# Altium schematic sheet PowerManager.SchDoc
size A4
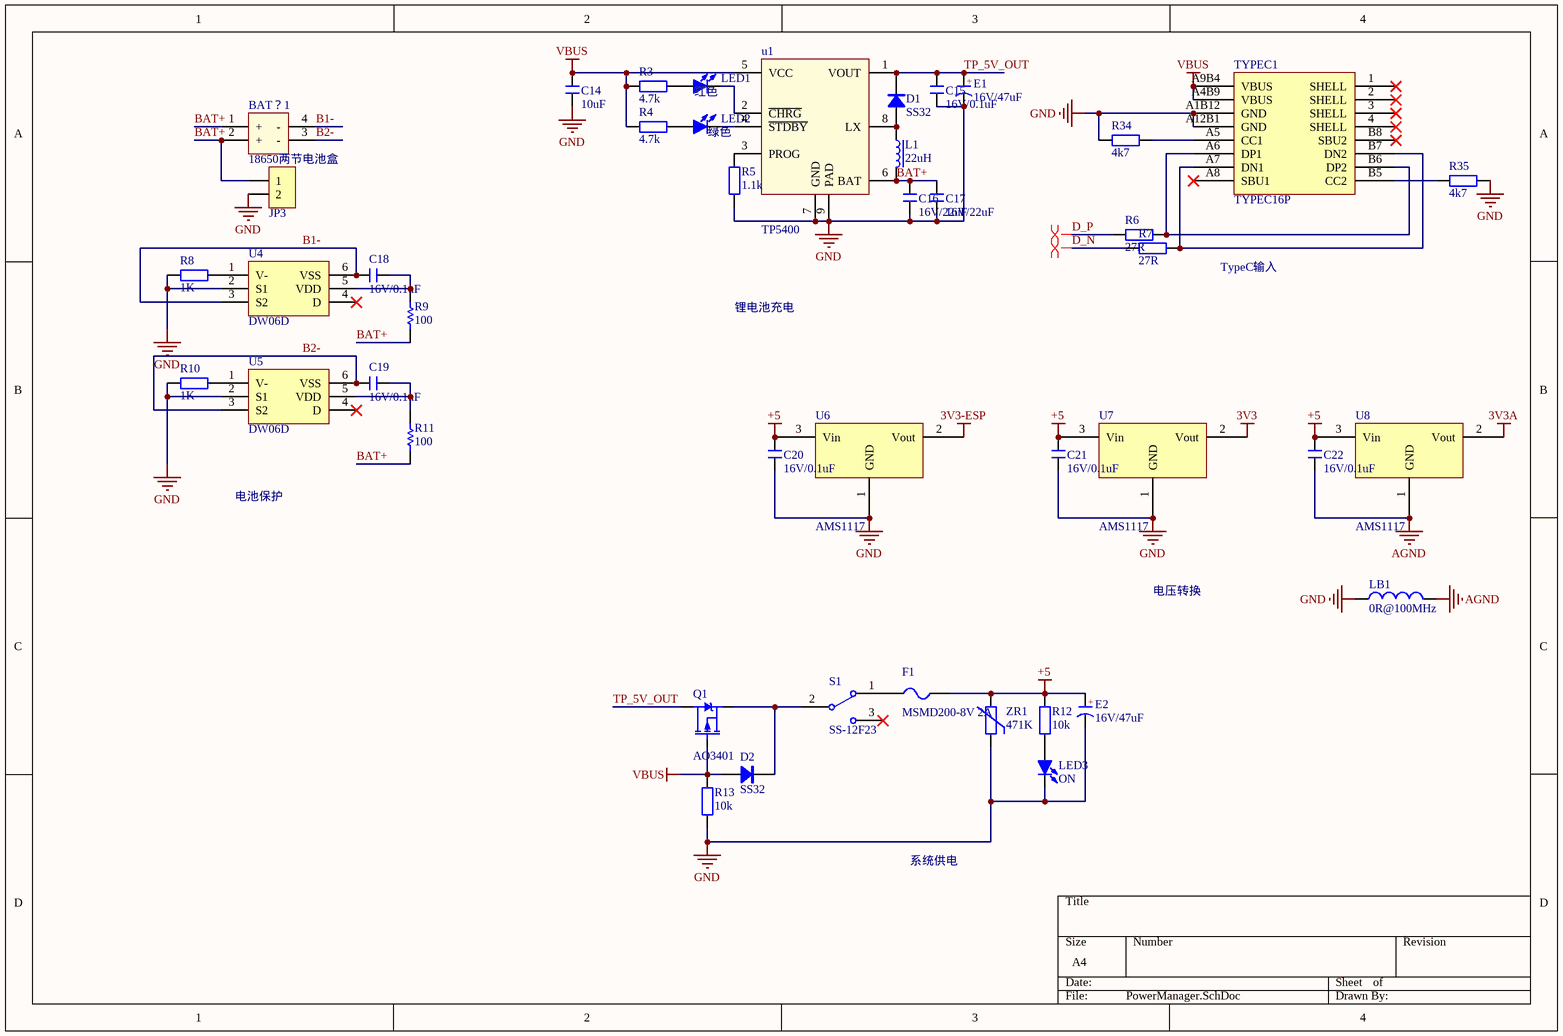
[diagram p0: PowerManager.SchDoc]

## Parts
BAT？1  18650两节电池盒  [18650两节电池盒]
C14  10uF  [C 0603_L]
C15  16V/0.1uF  [C 1206_L]
C16  16V/22uF  [C 1206_L]
C17  16V/22uF  [C 1206_L]
C18  16V/0.1uF  [C 1206_L]
C19  16V/0.1uF  [C 1206_L]
C20  16V/0.1uF  [C 1206_L]
C21  16V/0.1uF  [C 1206_L]
C22  16V/0.1uF  [C 1206_L]
D1  SS32  [SMA]
D2  SS32  [SMA]
E1  16V/47uF  [CM C(5*5.4)]
E2  16V/47uF  [CM C(5*5.4)]
F1  MSMD200-8V 2A  [FU 1206]
JP3  HDR-1X2  [XH2.54-WS-2P]  (value not drawn)
L1  22uH  [NR4020]
LB1  0R@100MHz  [FB 1206_L]
LED1  红色  [LED 0603R]
LED2  绿色  [LED 0603G]
LED3  ON  [LED 0603R]
Q1  AO3401  [SOT23]
R3  4.7k  [R 0603_L]
R4  4.7k  [R 0603_L]
R5  1.1k  [R 0603_L]
R6  27R  [R 0603_L]
R7  27R  [R 0603_L]
R8  1K  [R 0603_L]
R9  100  [0603R]
R10  1K  [R 0603_L]
R11  100  [0603R]
R12  10k  [R 0603_L]
R13  10k  [R 0603_L]
R34  4k7  [R 0603_L]
R35  4k7  [R 0603_L]
S1  SS-12F23  [SK-12D07VG3]
TYPEC1  TYPEC16P  [TYPEC-16P]
u1  TP5400  [ESOP8]
U4  DW06D  [SOT23-6]
U5  DW06D  [SOT23-6]
U6  AMS1117  [SOT89]
U7  AMS1117  [SOT89]
U8  AMS1117  [SOT89]
ZR1  471K  [R 0603_L]

## Nets
3V3: U7.2(Vout)
3V3-ESP: U6.2(Vout)
3V3A: U8.2(Vout)
+5: C20.2 C21.2 C22.2 E2.1(A) F1.2 R12.2 U6.3(Vin) U7.3(Vin) U8.3(Vin) ZR1.2
AGND: C22.1 LB1.2 U8.1(GND)
GND: C14.1 C15.1 C16.1 C17.1 C20.1 C21.1 E1.2(K) E2.2(K) JP3.2 LB1.1 LED3.2(K) R5.1 R8.1 R10.1 R13.1 R34.1 R35.1 TYPEC1.A1B12(GND) TYPEC1.A12B1(GND) u1.7(GND) u1.9(PAD) U4.2(S1) U5.2(S1) U6.1(GND) U7.1(GND) ZR1.1
VBUS: C14.2 D2.1(A) Q1.G R3.2 R4.2 R13.2 TYPEC1.A4B9(VBUS) TYPEC1.A9B4(VBUS) u1.5(VCC)
B1-: BAT？1.4(-) C18.2 U4.3(S2) U4.6(VSS)
B2-: BAT？1.3(-) C19.2 U5.3(S2) U5.6(VSS)
BAT+: BAT？1.1(+) BAT？1.2(+) C16.2 C17.2 JP3.1 L1.2 R9.2 R11.2 u1.6(BAT)
D_N: R7.1
D_P: R6.1
TP_5V_OUT: C15.2 D1.2(K) E1.1(A) Q1.D u1.1(VOUT)
NetC18_1: C18.1 R9.1 U4.5(VDD)
NetC19_1: C19.1 R11.1 U5.5(VDD)
NetD1_1: D1.1(A) L1.1 u1.8(LX)
NetD2_2: D2.2(K) Q1.S S1.2
NetF1_1: F1.1 S1.1
NetLED1_1: LED1.1(A) R3.1
NetLED1_2: LED1.2(K) u1.2(~{CHRG})
NetLED2_1: LED2.1(A) R4.1
NetLED2_2: LED2.2(K) u1.4(~{STDBY})
NetLED3_1: LED3.1(A) R12.1
NetR5_2: R5.2 u1.3(PROG)
NetR6_2: R6.2 TYPEC1.A6(DP1) TYPEC1.B6(DP2)
NetR7_2: R7.2 TYPEC1.A7(DN1) TYPEC1.B7(DN2)
NetR8_2: R8.2 U4.1(V-)
NetR10_2: R10.2 U5.1(V-)
NetR34_2: R34.2 TYPEC1.A5(CC1)
NetR35_2: R35.2 TYPEC1.B5(CC2)

Not connected (* = marked no-connect by the designer): S1 3*; TYPEC1 1(SHELL)* 2(SHELL)* 3(SHELL)* 4(SHELL)* A8(SBU1)* B8(SBU2)*; U4 4(D)*; U5 4(D)*

## Layout directives
differential pair: D_N, D_P

## Notes on the sheet
- 锂电池充电
- TypeC输入
- 电池保护
- 电压转换
- 系统供电
- (in symbol C-CM) +

## Library data of the parts
C14-C22 = C: 无极性贴片电容; 版权归属: 源创客; 材质: X7R; BOM名称: 无极性贴片电容; 学习资源: www.ooocke.com
D1 D2 = SS210: 肖特基二极管; 版权归属: 源创客; BOM名称: 肖特基二极管; 学习资源: www.ooocke.com
E1 E2 = C-CM: 贴片电解电容; 版权归属: 源创客; BOM名称: 贴片电解电容; 学习资源: www.ooocke.com
F1 = FU: 贴片保险丝; 版权归属: 源创客; BOM名称: 贴片保险丝; 学习资源: www.ooocke.com
JP3 = Header 2: 2P接插件; 版权归属: 源创客; BOM名称: 2P接插件; 学习资源: www.ooocke.com
L1 = L-NR: NR磁胶电感; 版权归属: 源创客; BOM名称: NR磁胶电感; 学习资源: www.ooocke.com
LB1 = LB: 磁珠; 版权归属: 源创客; BOM名称: 磁珠; 学习资源: www.ooocke.com
LED1-LED3 = LED-SMD: 贴片LED; 版权归属: 源创客; BOM名称: 贴片LED; 学习资源: www.ooocke.com
Q1 = P-MOS: P沟道场效应管
R3-R8 R10 R12 R13 R34 R35 = R: 贴片电阻; 版权归属: 源创客; BOM名称: 贴片电阻; 学习资源: www.ooocke.com
R9 R11 = RES
S1 = SSW-1P: 1路波动开关; BOM名称: 波动开关; 版权归属: 源创客; 学习资源: www.ooocke.com
U6-U8 = AMS1117: 三端稳压芯片
ZR1 = R_VDR: 压敏电阻; 版权归属: 源创客; BOM名称: 压敏电阻; 学习资源: www.ooocke.com